# EAGLE design clock_v0.6 (EAGLE 9.6.2)
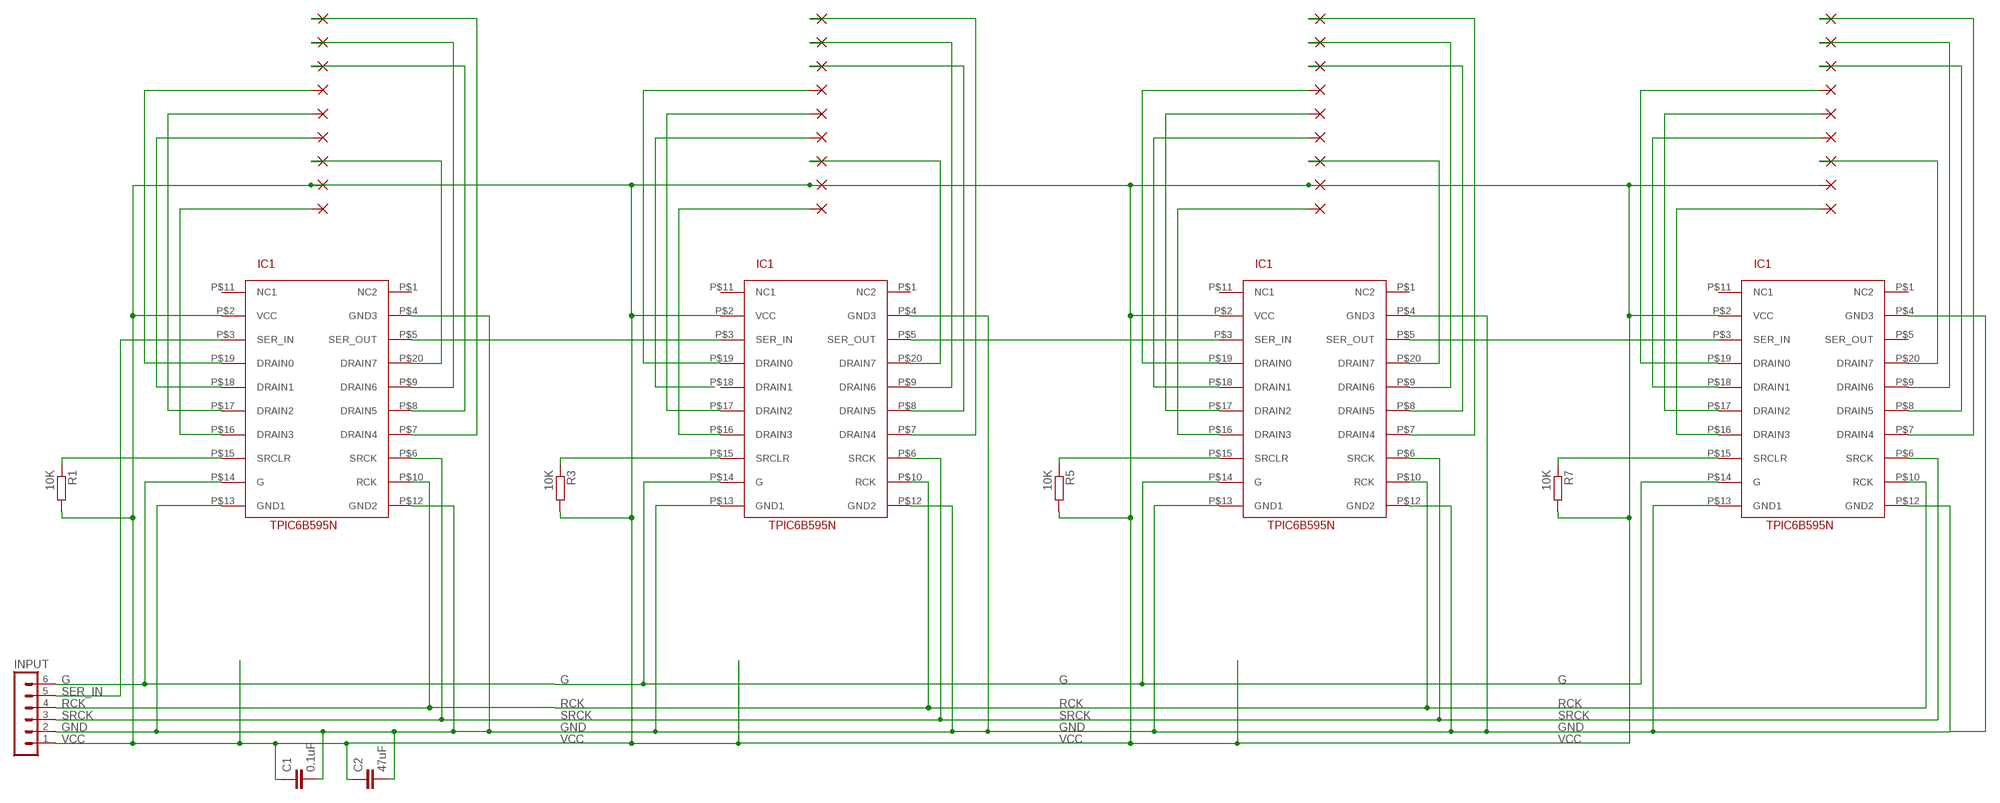
[diagram p0: schematic, sheet 1]

## Parts
C1  0.1uF  RCL_C-EU025-025X050  [RCL_C025-025X050]
C2  47uF  RCL_C-EU025-025X050  [RCL_C025-025X050]
DEC1  1,6/0,8  [1,6/0,8]
DEC2  1,6/0,8  [1,6/0,8]
DEC4  1,6/0,8  [1,6/0,8]
DEC6  1,6/0,8  [1,6/0,8]
INPUT  CON-LSTB_MA06-1  [CON-LSTB_MA06-1]
R1  10K  RCL_R-EU_0207/7  [RCL_0207/7]
R3  10K  RCL_R-EU_0207/7  [RCL_0207/7]
R5  10K  RCL_R-EU_0207/7  [RCL_0207/7]
R7  10K  RCL_R-EU_0207/7  [RCL_0207/7]
SEGA1  1,6/0,8  [1,6/0,8]
SEGA2  1,6/0,8  [1,6/0,8]
SEGA4  1,6/0,8  [1,6/0,8]
SEGA6  1,6/0,8  [1,6/0,8]
SEGB1  1,6/0,8  [1,6/0,8]
SEGB2  1,6/0,8  [1,6/0,8]
SEGB4  1,6/0,8  [1,6/0,8]
SEGB6  1,6/0,8  [1,6/0,8]
SEGC1  1,6/0,8  [1,6/0,8]
SEGC2  1,6/0,8  [1,6/0,8]
SEGC4  1,6/0,8  [1,6/0,8]
SEGC6  1,6/0,8  [1,6/0,8]
SEGD1  1,6/0,8  [1,6/0,8]
SEGD2  1,6/0,8  [1,6/0,8]
SEGD4  1,6/0,8  [1,6/0,8]
SEGD6  1,6/0,8  [1,6/0,8]
SEGE1  1,6/0,8  [1,6/0,8]
SEGE2  1,6/0,8  [1,6/0,8]
SEGE4  1,6/0,8  [1,6/0,8]
SEGE6  1,6/0,8  [1,6/0,8]
SEGF1  1,6/0,8  [1,6/0,8]
SEGF2  1,6/0,8  [1,6/0,8]
SEGF4  1,6/0,8  [1,6/0,8]
SEGF6  1,6/0,8  [1,6/0,8]
SEGG1  1,6/0,8  [1,6/0,8]
SEGG2  1,6/0,8  [1,6/0,8]
SEGG4  1,6/0,8  [1,6/0,8]
SEGG6  1,6/0,8  [1,6/0,8]
U$1  TPIC6B595N_TPIC6B595NPDIP-20  [TPIC6B595N_PDIP-20]
U$3  TPIC6B595N_TPIC6B595NPDIP-20  [TPIC6B595N_PDIP-20]
U$5  TPIC6B595N_TPIC6B595NPDIP-20  [TPIC6B595N_PDIP-20]
U$7  TPIC6B595N_TPIC6B595NPDIP-20  [TPIC6B595N_PDIP-20]
VCC1  1,6/0,8  [1,6/0,8]
VCC2  1,6/0,8  [1,6/0,8]
VCC4  1,6/0,8  [1,6/0,8]
VCC6  1,6/0,8  [1,6/0,8]

## Nets
G: INPUT.6 U$1.P$14(G) U$3.P$14(G) U$5.P$14(G) U$7.P$14(G)
GND [ground]: C1.2 C2.2 INPUT.2 U$1.P$4(GND3) U$1.P$12(GND2) U$1.P$13(GND1) U$3.P$4(GND3) U$3.P$12(GND2) U$3.P$13(GND1) U$5.P$4(GND3) U$5.P$12(GND2) U$5.P$13(GND1) U$7.P$4(GND3) U$7.P$12(GND2) U$7.P$13(GND1)
N$1: R1.1 U$1.P$15(SRCLR)
N$2: SEGA1.1(P) U$1.P$19(DRAIN0)
N$3: SEGA2.1(P) U$3.P$19(DRAIN0)
N$4: SEGA4.1(P) U$5.P$19(DRAIN0)
N$5: SEGA6.1(P) U$7.P$19(DRAIN0)
N$6: SEGB1.1(P) U$1.P$18(DRAIN1)
N$7: SEGB2.1(P)
N$8: SEGB4.1(P) U$5.P$18(DRAIN1)
N$9: SEGB6.1(P) U$7.P$18(DRAIN1)
N$10: U$1.P$5(SER_OUT) U$3.P$3(SER_IN)
N$11: U$3.P$5(SER_OUT) U$5.P$3(SER_IN)
N$12: U$5.P$5(SER_OUT) U$7.P$3(SER_IN)
N$13: SEGC1.1(P) U$1.P$17(DRAIN2)
N$14: SEGC2.1(P) U$3.P$17(DRAIN2)
N$15: SEGC4.1(P) U$5.P$17(DRAIN2)
N$16: SEGC6.1(P) U$7.P$17(DRAIN2)
N$17: SEGD1.1(P) U$1.P$16(DRAIN3)
N$18: SEGD2.1(P) U$3.P$16(DRAIN3)
N$19: R3.1 U$3.P$15(SRCLR)
N$20: SEGD4.1(P) U$5.P$16(DRAIN3)
N$21: SEGD6.1(P) U$7.P$16(DRAIN3)
N$22: SEGE1.1(P) U$1.P$7(DRAIN4)
N$23: SEGE2.1(P) U$3.P$7(DRAIN4)
N$24: SEGE4.1(P) U$5.P$7(DRAIN4)
N$25: SEGE6.1(P) U$7.P$7(DRAIN4)
N$26: SEGF1.1(P) U$1.P$8(DRAIN5)
N$27: SEGF2.1(P) U$3.P$8(DRAIN5)
N$28: SEGF4.1(P) U$5.P$8(DRAIN5)
N$29: SEGF6.1(P) U$7.P$8(DRAIN5)
N$30: SEGG1.1(P) U$1.P$9(DRAIN6)
N$31: SEGG2.1(P) U$3.P$9(DRAIN6)
N$32: SEGG4.1(P) U$5.P$9(DRAIN6)
N$33: SEGG6.1(P) U$7.P$9(DRAIN6)
N$34: DEC1.1(P) U$1.P$20(DRAIN7)
N$35: DEC2.1(P) U$3.P$20(DRAIN7)
N$36: DEC4.1(P) U$5.P$20(DRAIN7)
N$37: R5.1 U$5.P$15(SRCLR)
N$38: DEC6.1(P) U$7.P$20(DRAIN7)
N$55: R7.1 U$7.P$15(SRCLR)
RCK: INPUT.4 U$1.P$10(RCK) U$3.P$10(RCK) U$5.P$10(RCK) U$7.P$10(RCK)
SER_IN: INPUT.5 U$1.P$3(SER_IN)
SRCK: INPUT.3 U$1.P$6(SRCK) U$3.P$6(SRCK) U$5.P$6(SRCK) U$7.P$6(SRCK)
VCC [vcc]: C1.1 C2.1 INPUT.1 R1.2 R3.2 R5.2 R7.2 U$1.P$2(VCC) U$3.P$2(VCC) U$5.P$2(VCC) U$7.P$2(VCC) VCC1.1(P) VCC2.1(P) VCC4.1(P) VCC6.1(P)
Unconnected: U$1.P$1(NC2) U$1.P$11(NC1) U$3.P$1(NC2) U$3.P$11(NC1) U$3.P$18(DRAIN1) U$5.P$1(NC2) U$5.P$11(NC1) U$7.P$1(NC2) U$7.P$5(SER_OUT) U$7.P$11(NC1)

## Library data of the parts
C1 C2 = v0.4:RCL_C-EU: CAPACITOR, European symbol; SPICEPREFIX: C
DEC1 DEC2 DEC4 DEC6 SEGA1 SEGA2 SEGA4 SEGA6 SEGB1 SEGB2 SEGB4 SEGB6 SEGC1 SEGC2 SEGC4 SEGC6 SEGD1 SEGD2 SEGD4 SEGD6 SEGE1 SEGE2 SEGE4 SEGE6 SEGF1 SEGF2 SEGF4 SEGF6 SEGG1 SEGG2 SEGG4 SEGG6 VCC1 VCC2 VCC4 VCC6 = wirepad:1,6/0,8: THROUGH-HOLE PAD
INPUT = v0.4:CON-LSTB_MA06-1: PIN HEADER; OC_FARNELL: unknown; OC_NEWARK: unknown
R1 R3 R5 R7 = v0.4:RCL_R-EU_: RESISTOR, European symbol; SPICEPREFIX: R
U$1 U$3 U$5 U$7 = v0.4:TPIC6B595N_TPIC6B595N

## Net classes
0 default: width 0.635 mm
1 vcc: width 1.27 mm
2 ground: width 1.27 mm

## Board
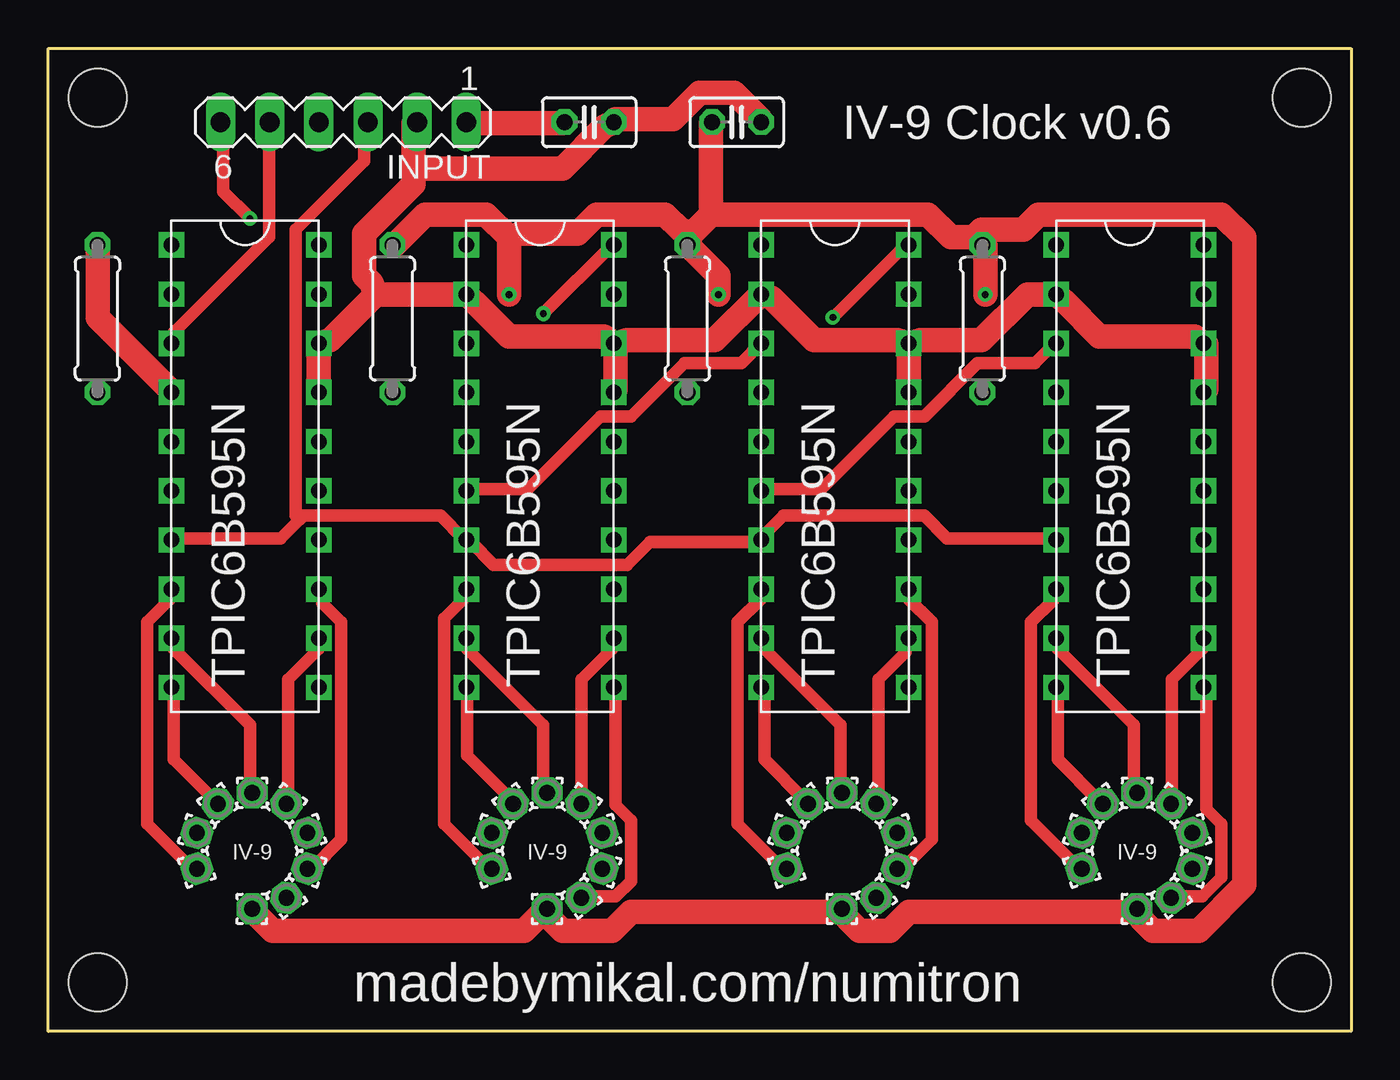
[diagram p1: board, top side]
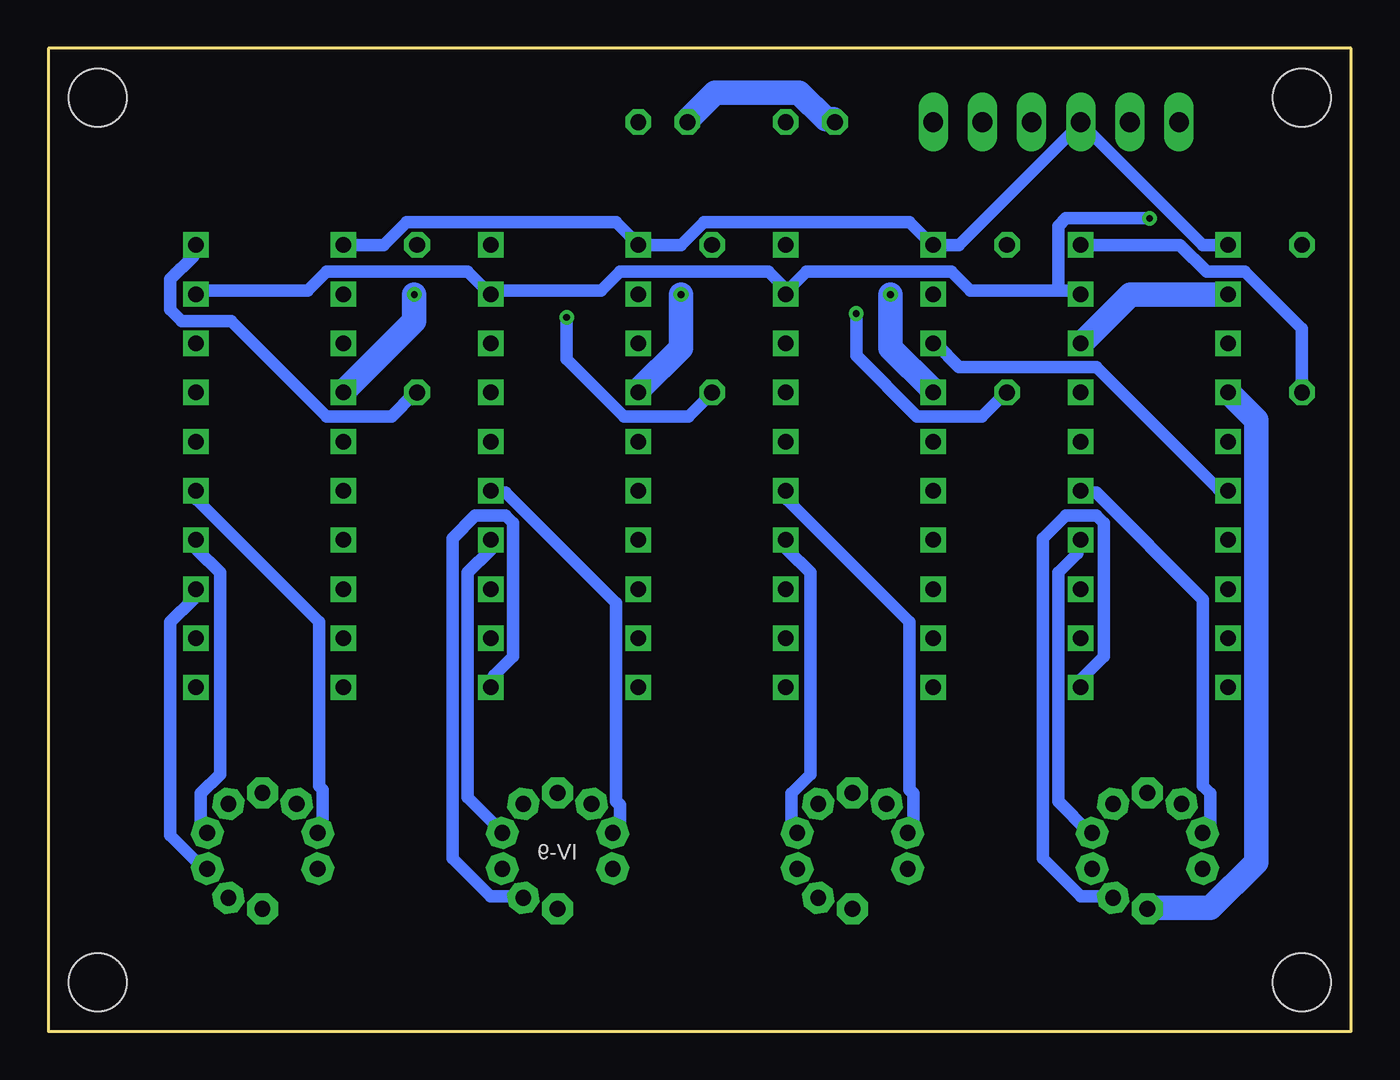
[diagram p2: board, bottom side, seen from below]

Size 67.31 x 50.8 mm. Coordinates in mm from the lower left corner, seen from the top.
Outline: 0,0 0,50.8 67.31,50.8 67.31,0 0,0
Copper layers (1*16): Top 0.035mm / dielectric 1.5mm / Bottom 0.035mm
Design rules "default": minimum track width 6mil, minimum drill 0.35mm, track to track 6mil, track to pad 6mil, pad to pad 6mil, via to via 6mil, smd to smd 6mil, copper to edge 40mil, drill to drill 6mil, minimum pad ring 10mil, minimum via ring 8mil, stop-mask expansion 4mil, vias tented up to drill 0mil, thermal gap 10mil
Holes 3 mm at 2.54,2.54 2.54,48.26 64.77,2.54 64.77,48.26

### Footprints (pad centres in the part's own frame; a part is rotated, then mirrored left to right if it is on the bottom)
RCL_C025-025X050 = drill 0.813 octagon: 1 -1.27,0; 2 1.27,0
1,6/0,8 = drill 0.813 pad 1.6 octagon: 1 0,0
CON-LSTB_MA06-1 = drill 1.016 long: 1 -6.35,0; 2 -3.81,0; 3 -1.27,0; 4 1.27,0; 5 3.81,0; 6 6.35,0
RCL_0207/7 = drill 0.813 octagon: 1 -3.81,0; 2 3.81,0
TPIC6B595N_PDIP-20 = drill 0.8 square: P$1 -3.81,1.27; P$2 -3.81,3.81; P$3 -3.81,6.35; P$4 -3.81,8.89; P$5 -3.81,-1.27; P$6 -3.81,-3.81; P$7 -3.81,-6.35; P$8 -3.81,-8.89; P$9 -3.81,-11.43; P$10 -3.81,11.43; P$11 3.81,1.27; P$12 3.81,3.81; P$13 3.81,6.35; P$14 3.81,8.89; P$15 3.81,11.43; P$16 3.81,-1.27; P$17 3.81,-3.81; P$18 3.81,-6.35; P$19 3.81,-8.89; P$20 3.81,-11.43

### Placement (x,y rotation side)
C1  35.56,46.99 0 top
C2  27.94,46.99 0 top
DEC1  12.29,6.91 306 top
DEC2  27.53,6.91 306 top
DEC4  42.77,6.91 306 top
DEC6  58.01,6.91 306 top
INPUT  15.24,46.99 180 top
R1  2.54,36.83 90 top
R3  17.78,36.83 90 top
R5  33.02,36.83 90 top
R7  48.26,36.83 90 top
SEGA1  12.29,11.76 144 top
SEGA2  27.53,11.76 144 top
SEGA4  42.77,11.76 144 top
SEGA6  58.01,11.76 144 top
SEGB1  13.38,8.41 342 top
SEGB2  28.62,8.41 342 top
SEGB4  43.86,8.41 342 top
SEGB6  59.1,8.41 342 top
SEGC1  13.38,10.26 18 top
SEGC2  28.62,10.26 18 top
SEGC4  43.86,10.26 18 top
SEGC6  59.1,10.26 18 top
SEGD1  7.67,10.26 162 top
SEGD2  22.91,10.26 162 top
SEGD4  38.15,10.26 162 top
SEGD6  53.39,10.26 162 top
SEGE1  7.67,8.41 198 top
SEGE2  22.91,8.41 198 top
SEGE4  38.15,8.41 198 top
SEGE6  53.39,8.41 198 top
SEGF1  10.53,12.33 90 top
SEGF2  25.77,12.33 90 top
SEGF4  41.01,12.33 90 top
SEGF6  56.25,12.33 90 top
SEGG1  8.76,11.76 126 top
SEGG2  24,11.76 126 top
SEGG4  39.24,11.76 126 top
SEGG6  54.48,11.76 126 top
U$1  10.16,29.21 0 top
U$3  25.4,29.21 0 top
U$5  40.64,29.21 0 top
U$7  55.88,29.21 0 top
VCC1  10.53,6.33 270 top
VCC2  25.77,6.33 270 top
VCC4  41.01,6.33 270 top
VCC6  56.25,6.33 270 top

### Tracks (layer width: path | path; a pad name or v marks a point on that pad's centre or on a via)
G  (via drill 0.35)
  Top 0.635: v10.41,42.02 9.04,43.4 9.04,46.94 INPUT.6
  Bottom 0.635: 15.14,38.28 19.67,38.28 20.65,39.26 28.13,39.26 29.11,38.28 U$3.P$14 29.31,38.48 30.1,39.26 37.78,39.26 38.76,38.28 44.27,38.28 U$5.P$14 44.67,38.28 45.65,39.26 52.93,39.26 53.92,38.28 59.63,38.28 U$7.P$14 | 15.14,38.28 14.15,38.28 U$1.P$14 | v10.41,42.02 14.75,42.02 15.14,41.62 15.14,38.28
GND
  Top 1.27: U$7.P$12 59.82,33.16 59.82,35.52 U$7.P$13 59.23,35.92 54.31,35.92 52.54,37.69 U$7.P$4 51.95,38.08 50.57,38.08 48.21,35.72 45.06,35.72 U$5.P$13 | U$5.P$12 44.47,33.16 44.47,35.52 U$5.P$13 | 29.31,35.52 29.31,33.16 U$3.P$12 | 29.31,35.52 U$3.P$13 28.72,35.92 23.8,35.92 22.03,37.69 U$3.P$4 21.44,38.08 16.91,38.08 | 29.31,35.52 29.9,35.72 34.43,35.72 36.79,38.08 U$5.P$4 37.38,37.88 39.55,35.72 43.88,35.72 U$5.P$13 | C1.2 36.79,47.14 35.41,48.51 33.64,48.51 32.26,47.14 29.31,47.14 C2.2 28.72,46.74 26.56,44.58 18.88,44.58 | U$1.P$12 13.96,33.16 13.96,35.52 U$1.P$13 14.55,35.72 16.91,38.08 | 18.88,44.58 18.88,43.79 16.32,41.23 16.32,39.07 16.71,38.67 16.91,38.08 | 18.88,44.58 18.88,46.94 INPUT.2
  Bottom 1.27: U$1.P$4 6.48,38.08 11.4,38.08 13.96,35.52 U$1.P$13
N$1
  Bottom 0.635: U$1.P$15 8.84,40.64 7.46,39.26 5.49,39.26 2.54,36.31 R1.1
N$2
  Top 0.635: U$1.P$19 13.96,20.17 13.96,19.77 12.38,18.2 12.38,11.9 SEGA1.1
N$3
  Top 0.635: U$3.P$19 29.11,20.17 29.11,19.77 27.54,18.2 27.54,11.9 SEGA2.1
N$4
  Top 0.635: U$5.P$19 44.27,20.17 44.27,19.58 42.89,18.2 42.89,11.9 SEGA4.1
N$5
  Top 0.635: U$7.P$19 59.63,20.17 59.63,19.77 58.05,18.2 58.05,11.9 SEGA6.1
N$6
  Top 0.635: U$1.P$18 14.15,22.73 14.15,22.14 15.14,21.15 15.14,9.93 13.56,8.36 SEGB1.1
N$8
  Top 0.635: U$5.P$18 44.47,22.73 44.47,22.33 45.65,21.15 45.65,9.93 44.27,8.55 43.88,8.55 SEGB4.1
N$9
  Bottom 0.635: U$7.P$18 59.82,22.73 59.82,22.33 61,21.15 61,10.13 59.23,8.36 SEGB6.1
N$10
  Bottom 0.635: U$1.P$5 6.48,28.04 6.87,28.04 13.17,34.34 20.26,34.34 21.44,35.52 U$3.P$3
N$11
  Top 0.635: U$5.P$3 35.81,34.54 32.86,34.54 30.1,31.78 28.52,31.78 24.78,28.04 21.63,28.04 U$3.P$5
N$12
  Top 0.635: U$5.P$5 36.99,28.04 39.94,28.04 43.68,31.78 45.26,31.78 48.01,34.54 50.96,34.54 51.95,35.52 U$7.P$3
N$13
  Bottom 0.635: U$1.P$17 14.15,25.29 14.15,24.7 15.14,23.71 15.14,11.9 13.56,10.32 SEGC1.1
N$14
  Bottom 0.635: U$3.P$17 29.11,25.29 29.11,24.89 27.93,23.71 27.93,13.28 28.92,12.29 28.92,10.52 28.72,10.32 SEGC2.1
N$15
  Bottom 0.635: U$5.P$17 44.47,25.29 44.47,24.89 45.65,23.71 45.65,12.1 43.88,10.32 SEGC4.1
N$16
  Bottom 0.635: U$7.P$17 59.63,25.29 59.63,24.89 58.45,23.71 58.45,13.28 59.43,12.29 59.43,10.52 59.23,10.32 SEGC6.1
N$17
  Bottom 0.635: U$1.P$16 13.96,27.84 13.17,27.84 7.66,22.33 7.66,12.69 7.26,12.29 7.26,10.72 7.66,10.32 SEGD1.1
N$18
  Bottom 0.635: U$3.P$16 29.11,27.84 29.11,27.45 22.82,21.15 22.82,12.49 22.62,12.29 22.62,10.52 22.82,10.32 SEGD2.1
N$19  (via drill 0.35)
  Top 0.635: v25.57,37.1 29.11,40.64 U$3.P$15
  Bottom 0.635: v25.57,37.1 25.57,34.93 22.42,31.78 19.07,31.78 17.89,32.96 R3.1
N$20
  Bottom 0.635: U$5.P$16 44.27,27.84 43.68,27.84 37.97,22.14 37.97,11.9 37.78,11.7 37.78,10.52 37.97,10.32 SEGD4.1
N$21
  Bottom 0.635: U$7.P$16 59.63,27.84 59.63,27.45 53.33,21.15 53.33,12.69 53.13,12.49 53.13,10.52 53.33,10.32 SEGD6.1
N$22
  Top 0.635: U$1.P$7 6.28,22.73 6.28,22.33 5.1,21.15 5.1,10.72 7.26,8.55 7.66,8.55 SEGE1.1
N$23
  Top 0.635: U$3.P$7 21.44,22.73 21.44,22.33 20.45,21.35 20.45,10.72 22.82,8.36 SEGE2.1
N$24
  Top 0.635: U$5.P$7 36.79,22.73 36.79,22.33 35.61,21.15 35.61,10.72 37.97,8.36 SEGE4.1
N$25
  Top 0.635: U$7.P$7 51.95,22.73 51.95,22.33 50.77,21.15 50.77,10.92 53.33,8.36 SEGE6.1
N$26
  Top 0.635: U$1.P$8 6.48,20.17 6.48,19.77 10.41,15.84 10.41,12.49 SEGF1.1
N$27
  Top 0.635: U$3.P$8 21.63,20.17 21.63,19.77 25.57,15.84 25.57,12.49 SEGF2.1
N$28
  Top 0.635: U$5.P$8 36.99,20.17 36.99,19.77 40.93,15.84 40.93,12.49 SEGF4.1
N$29
  Top 0.635: U$7.P$8 52.15,20.17 52.15,19.77 56.08,15.84 56.08,12.49 SEGF6.1
N$30
  Top 0.635: U$1.P$9 6.48,17.61 6.48,14.06 8.64,11.9 SEGG1.1
N$31
  Top 0.635: U$3.P$9 21.63,17.61 21.63,14.26 24,11.9 SEGG2.1
N$32
  Top 0.635: U$5.P$9 36.99,17.61 36.99,14.06 39.15,11.9 SEGG4.1
N$33
  Top 0.635: U$7.P$9 52.15,17.61 52.15,14.06 54.31,11.9 SEGG6.1
N$34
  Bottom 0.635: U$1.P$20 13.96,17.8 13.96,18.2 12.78,19.38 12.78,26.27 13.17,26.66 14.75,26.66 15.93,25.48 15.93,8.95 13.96,6.98 12.38,6.98 DEC1.1
N$35
  Top 0.635: U$3.P$20 29.31,17.61 29.31,11.7 30.1,10.92 30.1,7.77 29.31,6.98 27.54,6.98 DEC2.1
N$36
  Bottom 0.635: U$5.P$20 44.27,17.8 44.27,18.4 43.29,19.38 43.29,26.27 43.68,26.66 45.26,26.66 46.44,25.48 46.44,8.95 44.47,6.98 42.89,6.98 DEC4.1
N$37  (via drill 0.35)
  Top 0.635: v40.53,36.9 44.27,40.64 U$5.P$15
  Bottom 0.635: v40.53,36.9 40.53,34.74 37.58,31.78 34.23,31.78 33.05,32.96 R5.1
N$38
  Top 0.635: U$7.P$20 59.82,17.61 59.82,11.51 60.61,10.72 60.61,7.96 59.63,6.98 58.05,6.98 DEC6.1
N$55
  Bottom 0.635: U$7.P$15 59.82,40.64 59.82,40.05 61,38.87 61,37.29 60.41,36.7 57.85,36.7 52.93,31.78 49.59,31.78 48.41,32.96 R7.1
RCK
  Bottom 0.635: U$1.P$10 7.66,40.64 13.96,46.94 INPUT.4 14.15,46.74 20.26,40.64 U$3.P$10 21.83,40.84 22.82,41.82 33.45,41.82 34.63,40.64 U$5.P$10 36.99,40.84 37.97,41.82 48.8,41.82 49.98,40.64 U$7.P$10
SER_IN
  Top 0.635: U$1.P$3 6.48,35.72 6.48,36.11 11.4,41.03 11.4,46.94 INPUT.5
SRCK
  Top 0.635: 12.97,26.47 13.17,26.66 20.26,26.66 21.44,25.48 U$3.P$6 21.83,25.29 23.01,24.11 29.9,24.11 31.08,25.29 36.79,25.29 U$5.P$6 36.99,25.68 37.97,26.66 45.26,26.66 46.44,25.48 51.95,25.48 U$7.P$6 | 12.97,26.47 11.99,25.48 6.48,25.48 U$1.P$6 | INPUT.3 16.32,46.94 16.32,44.97 12.78,41.43 12.78,26.66 12.97,26.47
VCC  (via drill 0.35)
  Top 1.27: 23.8,41.03 v23.8,38.08 | 23.8,41.03 22.62,42.22 19.47,42.22 17.89,40.64 R3.2 | v48.41,38.08 48.41,40.64 R7.2 47.82,41.03 | C2.1 26.56,46.94 21.63,46.94 INPUT.1 | v34.63,38.08 34.63,39.07 33.05,40.64 R5.2 33.25,41.23 | 34.23,42.22 34.23,46.94 C1.1 | 33.25,41.23 34.23,42.22 | 47.82,41.03 46.63,41.03 45.45,42.22 34.23,42.22 | 23.8,41.03 24.39,41.23 27.34,41.23 28.33,42.22 31.87,42.22 32.66,41.43 33.25,41.23 | R1.2 2.54,36.9 6.28,33.16 U$1.P$2 | VCC1.1 10.61,6.19 11.59,5.21 24.59,5.21 25.57,6.19 VCC2.1 25.96,5.8 26.56,5.21 29.11,5.21 30.1,6.19 40.93,6.19 VCC4.1 41.32,5.8 41.91,5.21 43.48,5.21 44.47,6.19 56.08,6.19 VCC6.1 56.48,5.8 57.07,5.21 59.43,5.21 61.79,7.57 61.79,41.03 60.61,42.22 51.16,42.22 50.38,41.43 48.21,41.43 47.82,41.03
  Bottom 1.27: v23.8,38.08 23.8,35.33 21.63,33.16 U$3.P$2 | v48.41,38.08 48.41,36.7 51.95,33.16 U$7.P$2 | v34.63,38.08 34.63,35.33 36.79,33.16 U$5.P$2 | C2.1 26.75,47.14 27.15,47.14 28.52,48.51 32.86,48.51 34.23,47.14 C1.1 | U$1.P$2 6.28,32.96 4.9,31.59 4.9,8.75 7.26,6.39 10.41,6.39 VCC1.1

### Text on the board
tPlace: IV-9 Clock v0.6 | IV-9 | IV-9 | IV-9 | madebymikal.com/numitron
bPlace: IV-9
tNames: TPIC6B595N | TPIC6B595N | TPIC6B595N | TPIC6B595N